# Altium schematic sheet punto5sq.SchDoc
size A4
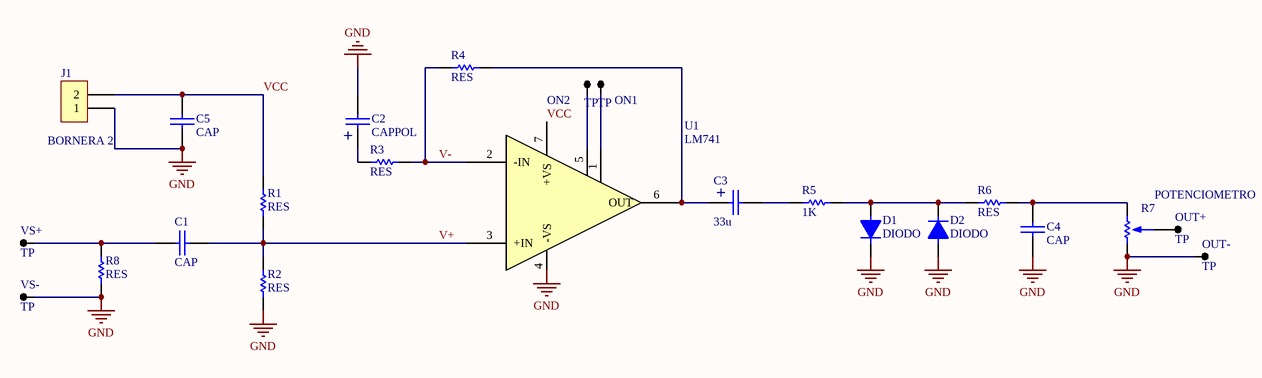
[diagram p0: punto5sq.SchDoc]

## Parts
C1  CAP  [CAP200]
C2  CAPPOL  [CAP100RP]
C3  33u  [CAP100RP]
C4  CAP  [CAP200]
C5  CAP  [CAP200]
D1  DIODO  [DO41]
D2  DIODO  [DO41]
J1  BORNERA 2  [BORNERA2]
ON1  TP  [TPTH]
ON2  TP  [TPTH]
OUT+  TP  [TPTH]
OUT-  TP  [TPTH]
R1  RES  [RES400]
R2  RES  [RES400]
R3  RES  [RES400]
R4  RES  [RES400]
R5  1K  [RES400]
R6  RES  [RES400]
R7  POTENCIOMETRO  [POTENCIOMETRO]
R8  RES  [RES400]
U1  LM741  [DIP8]
VS+  TP  [TPTH]
VS-  TP  [TPTH]

## Nets
GND: C2.2 C4.2 C5.2 D1.2 D2.1 J1.1 OUT-.1 R2.1 R7.3 R8.2 U1.4(-VS) VS-.1
V+: C1.1 R1.1 R2.2 U1.3(+IN)
V-: R3.2 R4.1 U1.2(-IN)
VCC: C5.1 J1.2 R1.2 U1.7(+VS)
NetC1_2: C1.2 R8.1 VS+.1
NetC2_1: C2.1 R3.1
NetC3_1: C3.1 R4.2 U1.6(OUT)
NetC3_2: C3.2 R5.1
NetC4_1: C4.1 R6.2 R7.1
NetD1_1: D1.1 D2.2 R5.2 R6.1
NetON1_1: ON1.1 U1.1(-RG)
NetON2_1: ON2.1 U1.5(+RG)
NetOUT+_1: OUT+.1 R7.2

## Notes on the sheet
- (in symbol CAPPOL) +

## Library data of the parts
C3 = CAPPOL
R5 = RES
U1 = LM741: LM741 Operational Amplifier